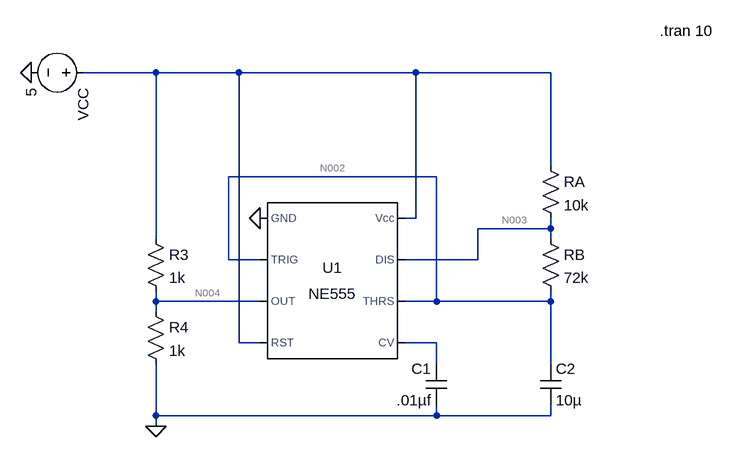
[diagram p0: schematic astableclock.asc]
astableclock.asc, the LTspice schematic file:
Version 4
SHEET 1 980 680
WIRE 112 -160 0 -160
WIRE 240 -160 112 -160
WIRE 512 -160 240 -160
WIRE 720 -160 512 -160
WIRE 720 -16 720 -160
WIRE 544 0 224 0
WIRE 512 64 512 -160
WIRE 512 64 496 64
WIRE 720 80 720 64
WIRE 720 80 608 80
WIRE 112 96 112 -160
WIRE 720 96 720 80
WIRE 224 128 224 0
WIRE 272 128 224 128
WIRE 608 128 608 80
WIRE 608 128 496 128
WIRE 112 192 112 176
WIRE 272 192 112 192
WIRE 544 192 544 0
WIRE 544 192 496 192
WIRE 720 192 720 176
WIRE 720 192 544 192
WIRE 112 208 112 192
WIRE 240 256 240 -160
WIRE 272 256 240 256
WIRE 544 256 496 256
WIRE 544 288 544 256
WIRE 720 288 720 192
WIRE 112 368 112 288
WIRE 544 368 544 352
WIRE 544 368 112 368
WIRE 720 368 720 352
WIRE 720 368 544 368
WIRE 112 384 112 368
FLAG 272 64 0
FLAG -80 -160 0
FLAG 112 384 0
SYMBOL voltage 16 -160 R90
WINDOW 123 0 0 Left 2
WINDOW 39 0 0 Left 2
SYMATTR InstName VCC
SYMATTR Value 5
SYMBOL Misc\\NE555 384 160 R0
SYMATTR InstName U1
SYMBOL cap 560 352 R180
WINDOW 0 24 56 Left 2
WINDOW 3 24 8 Left 2
SYMATTR InstName C1
SYMATTR Value .01µf
SYMBOL res 96 80 R0
SYMATTR InstName R3
SYMATTR Value 1k
SYMBOL res 96 192 R0
SYMATTR InstName R4
SYMATTR Value 1k
SYMBOL res 704 80 R0
SYMATTR InstName RB
SYMATTR Value 72k
SYMBOL cap 704 288 R0
SYMATTR InstName C2
SYMATTR Value 10µ
SYMBOL res 704 -32 R0
SYMATTR InstName RA
SYMATTR Value 10k
TEXT 888 -224 Left 2 !.tran 10

The netlist it stands for:
* astableclock.asc
VCC N001 0 5
XU1 0 N002 N004 N001 N005 N002 N003 N001 NE555  ; pins GND TRIG OUT RST CV THRS DIS Vcc
C1 0 N005 .01µf
R3 N001 N004 1k
R4 N004 0 1k
RB N003 N002 72k
C2 N002 0 10µ
RA N001 N003 10k
.tran 10
.lib NE555.sub
.backanno
.end

* Results of the author's LTspice run, read from the files saved beside the schematic
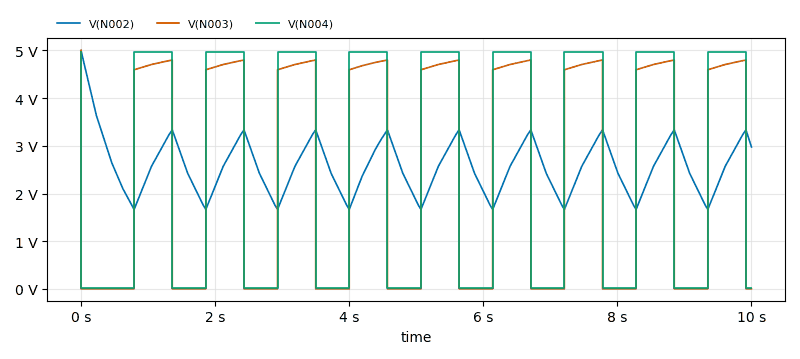
[diagram p1: Transient Analysis of astableclock.asc, plotted from the saved traces]
* Transient Analysis, 1 run:
*   V(N002): min 1.666 V, max 4.999 V, average 2.559 V, rms 2.639 V, last 2.975 V
*   V(N003): min 3.137 mV, max 5 V, average 2.412 V, rms 3.368 V, last 3.246 mV
*   V(N004): min 29.67 mV, max 4.97 V, average 2.561 V, rms 3.558 V, last 29.67 mV